# EasyEDA Pro project G1_双向DC.eprj

# Schematic 双向DC-DC
Board Name: 双向DC-DC; Create Date: 2025-09-13; Page Name: Sheet_1; Project Name: G1_双向DC; Schematic Name: 双向DC-DC; Update Date: 2026-01-24; Add into BOM: yes; Company: Your Company; Convert to PCB: yes; Date: 2022-06-02; Draw By: yy1y4n9; REV: 1.0; Sheet: 1/1
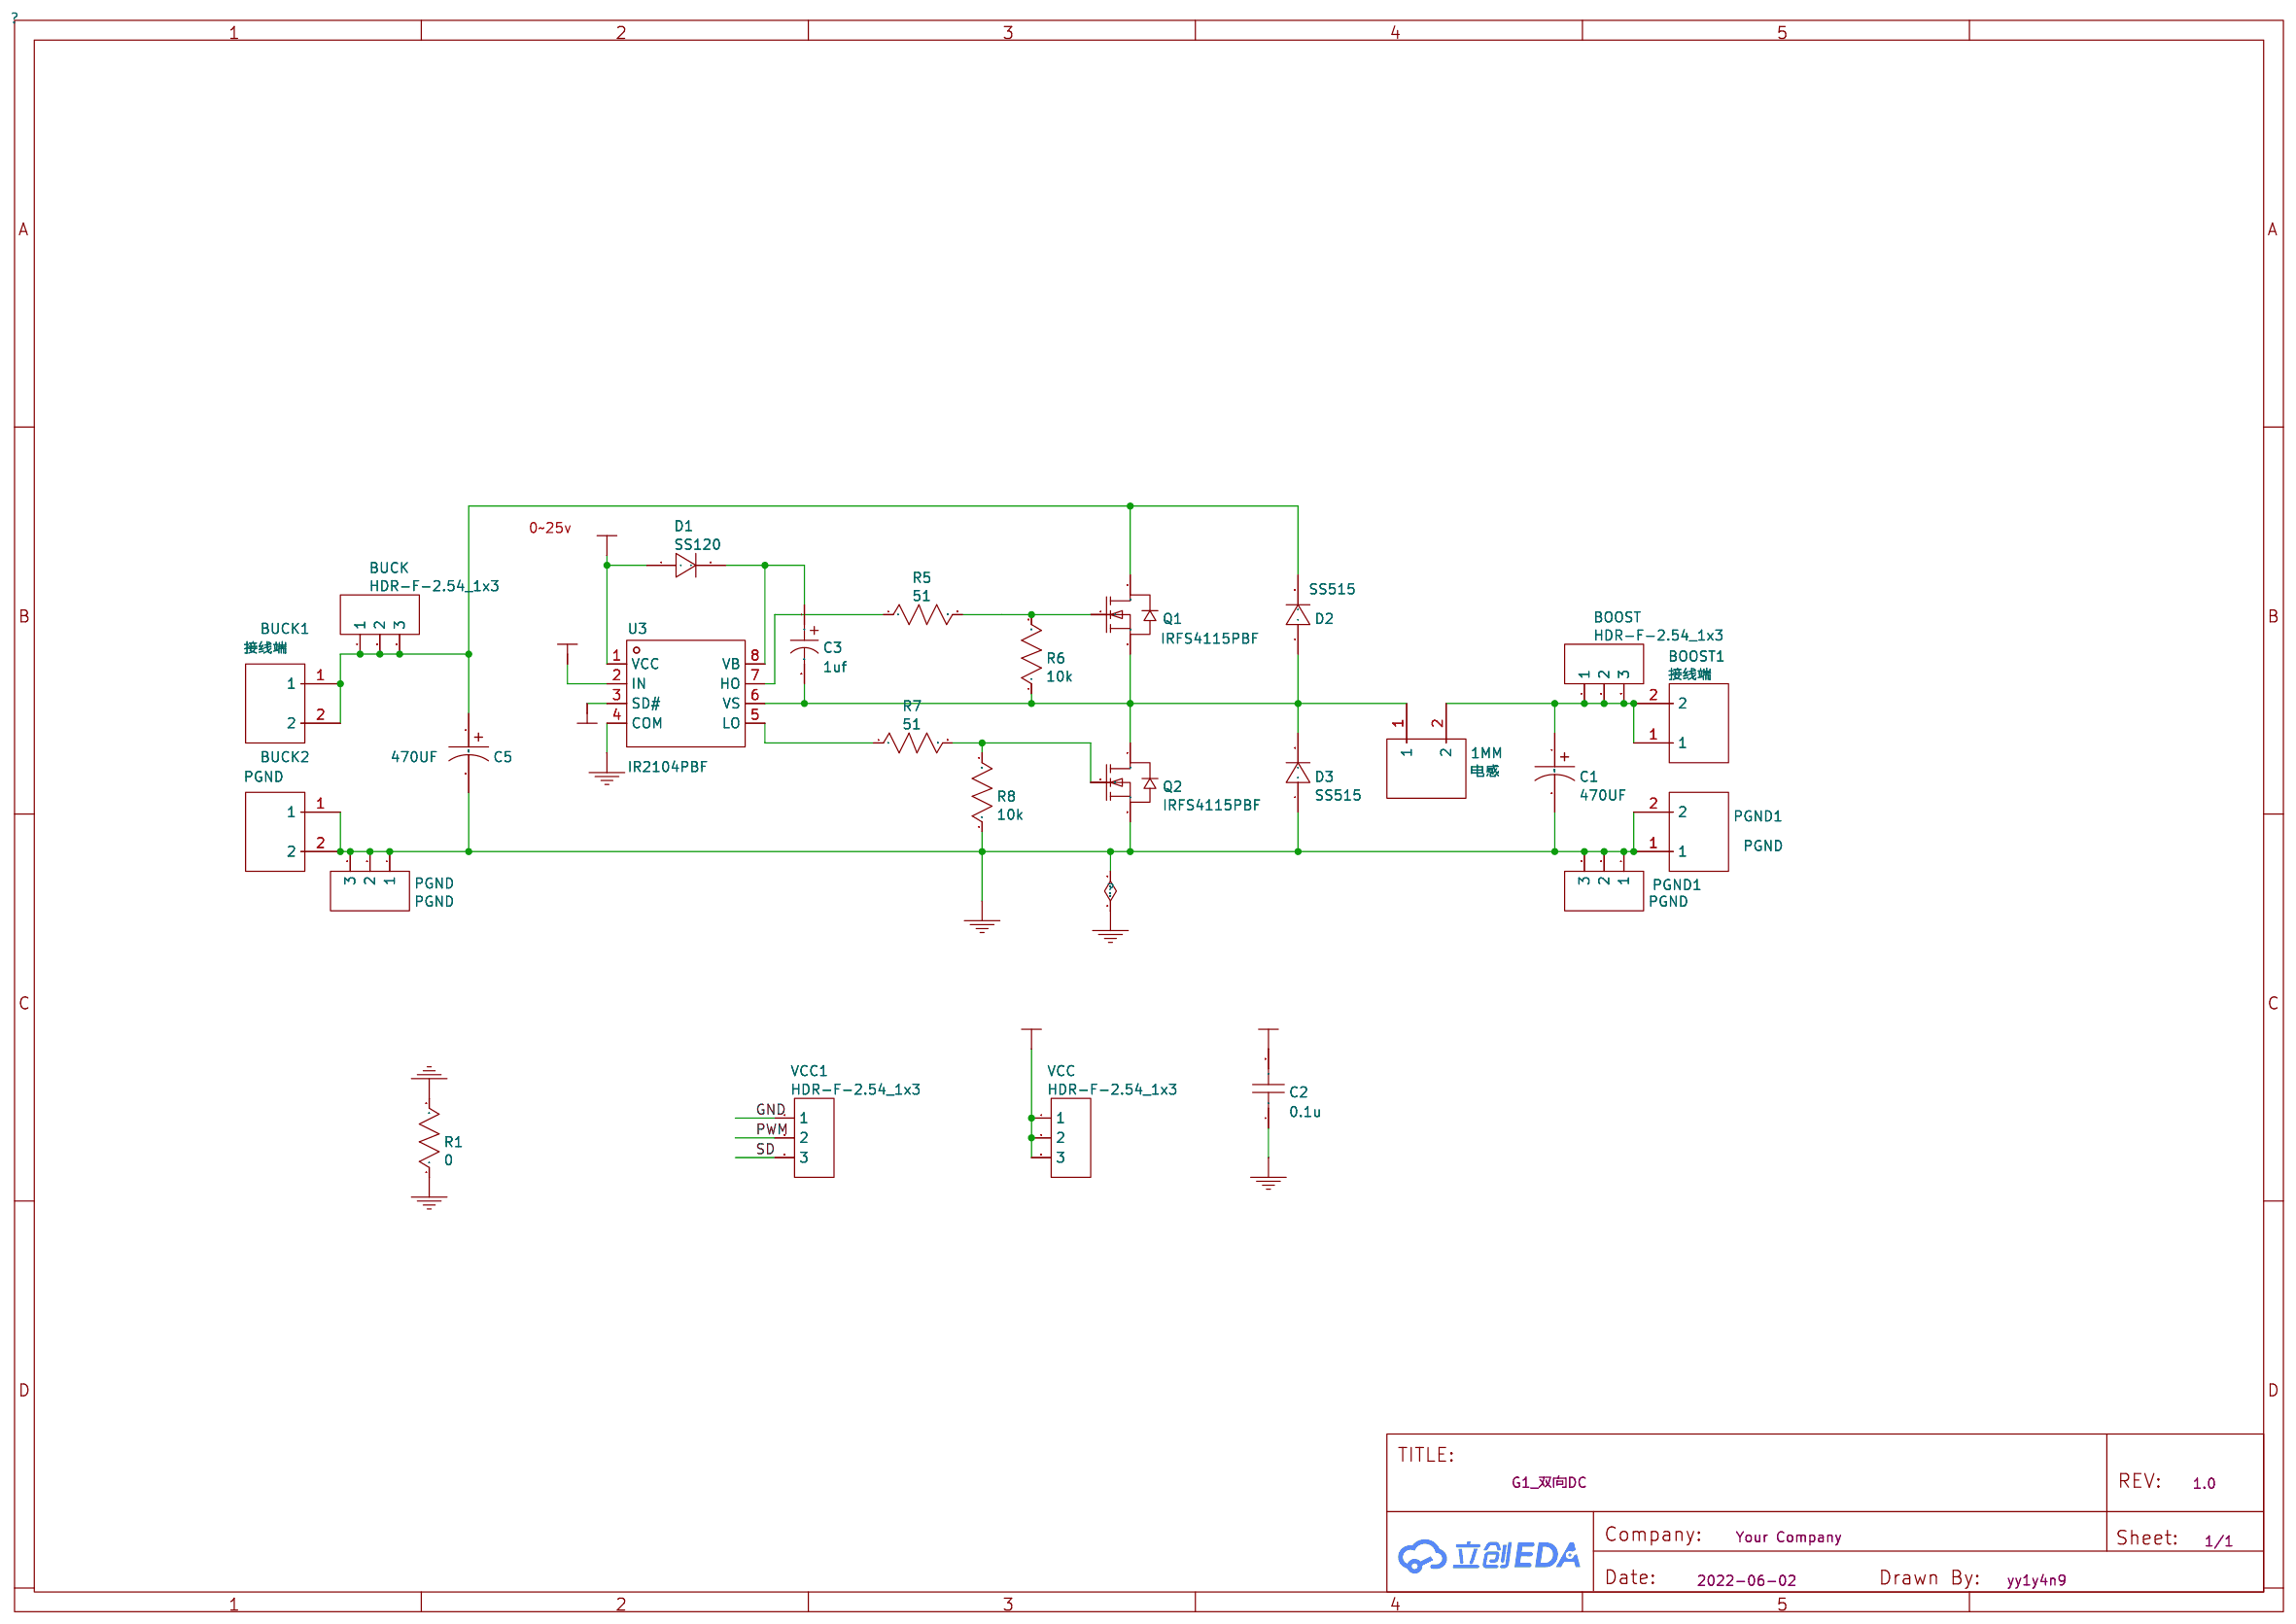
[diagram p0: schematic sheet]

## Parts
1MM  电感  [大电感2.6MM]
BOOST  HDR-F-2.54_1x3  [HDR-F-2.54_1X3]
BOOST1  接线端  [2P接线端子2]
BUCK  HDR-F-2.54_1x3  [HDR-F-2.54_1X3]
BUCK1  接线端  [2P接线端子2]
BUCK2  PGND  [2P接线端子2]
C1  470UF  [电解电容470/100V_16_7.62]
C2  0.1u  [C0805]
C3  1uf  [钽电容A型]
C5  470UF  [电解电容470/100V_16_7.62]
D1  SS120  [SMA封装]
D2  SS515  [SMA封装]
D3  SS515  [SMA封装]
PGND  PGND  [HDR-F-2.54_1X3]
PGND1  PGND  [HDR-F-2.54_1X3]
PGND1#2  PGND  [2P接线端子2]
Q1  IRFS4115PBF  [TO-220AB-3_L10.4-W4.6-P2.54-L]
Q2  IRFS4115PBF  [TO-220AB-3_L10.4-W4.6-P2.54-L]
R1  0  [R0805]
R5  51  [R0805]
R6  10k  [R0805]
R7  51  [R0805]
R8  10k  [R0805]
U3  IR2104PBF  [DIP-8_L9.9-W6.6-P2.54-LS7.62-BL]
VCC  HDR-F-2.54_1x3  [HDR-F-2.54_1X3]
VCC1  HDR-F-2.54_1x3  [HDR-F-2.54_1X3]

## Library data of the parts
1MM = 电感: Supplier: LCSC; Manufacturer: ReliaPro; Manufacturer Part: WJ126V-5.0-2P; image: //image.lceda.cn/szlcsc/C8404.jpg; Supplier Part: C8404
BOOST BUCK PGND PGND1 VCC VCC1 = HDR-F-2.54_1x3: Supplier Part: C146690; Supplier: LCSC
BOOST1 BUCK1 BUCK2 PGND1#2 = 接线端: Supplier: LCSC; Manufacturer: ReliaPro; Manufacturer Part: WJ126V-5.0-2P; image: //image.lceda.cn/szlcsc/C8404.jpg; Supplier Part: C8404
C1 C5 = 1u
C2 = 0.1u
C3 = C1: Supplier: LCSC; Supplier Part: C9900012632; Manufacturer: null; Manufacturer Part: 江海电解电容CD26325V/470uF体积10*12.5mm; JLCPCB Part Class: Extended Part
D1 = M7
D2 D3 = RF307G
Q1 Q2 = IRF540N: Supplier: LCSC; Supplier Part: C693382; Manufacturer: VBsemi Elec; JLCPCB Part Class: Extended Part
R1 = 0
R5-R8 = 1k
U3 = IR2104PBF: 驱动配置:半桥;负载类型:MOSFET；IGBT;驱动通道数:2;峰值灌电流:360mA;峰值拉电流:210mA;电源电压:10V~20V;上升时间:100ns;下降时间:50ns;; LCSC Part Name: IR2104PBF 停产; Supplier Part: C2959; Manufacturer: Infineon(英飞凌); Supplier Footprint: PDIP-8; Datasheet: https://atta.szlcsc.com/upload/public/pdf/source/20140906/1457707236579.pdf; Supplier: LCSC; Driven Configuration: 半桥; Load Type: MOSFET；IGBT; Number of Drivers: 2; Peak Output Current(sink): 360mA; Peak Output Current(source): 210mA; Supply Voltage: 10V~20V; Rise Time: 100ns; Fall Time: 50ns; Operating Temperature: -40℃~+150℃@(Tj)

## Nets
GND: BUCK2.1 BUCK2.2 C1.2 C2.1 C5.2 D3.1(A) PGND.1 PGND.2 PGND.3 PGND1.1 PGND1.2 PGND1.3 PGND1#2.1 PGND1#2.2 Q2.3(S) R1.1 R1.2 R8.1 U3.4(COM) VCC1.1
VCC: C2.2 D1.1(A) U3.1(VCC) VCC.1 VCC.2 VCC.3
PWM: U3.2(IN) VCC1.2
SD: U3.3(SD#) VCC1.3
$1N5: C3.1 D1.2(K) U3.8(VB)
$1N6: 1MM.1 C3.2 D2.1(A) D3.2(K) Q1.3(S) Q2.2(D) R6.1 U3.6(VS)
$1N12: Q2.1(G) R7.2 R8.2
$1N13: R7.1 U3.5(LO)
$1N14: R5.1 U3.7(HO)
$1N15: Q1.1(G) R5.2 R6.2
$1N3304: 1MM.2 BOOST.1 BOOST.2 BOOST.3 BOOST1.1 BOOST1.2 C1.1
$1N5227: BUCK.1 BUCK.2 BUCK.3 BUCK1.1 BUCK1.2 C5.1 D2.2(K) Q1.2(D)

## Notes on the sheet
- 0~25v

# Board PCB_双向DC-DC_大电感_2024-05-11
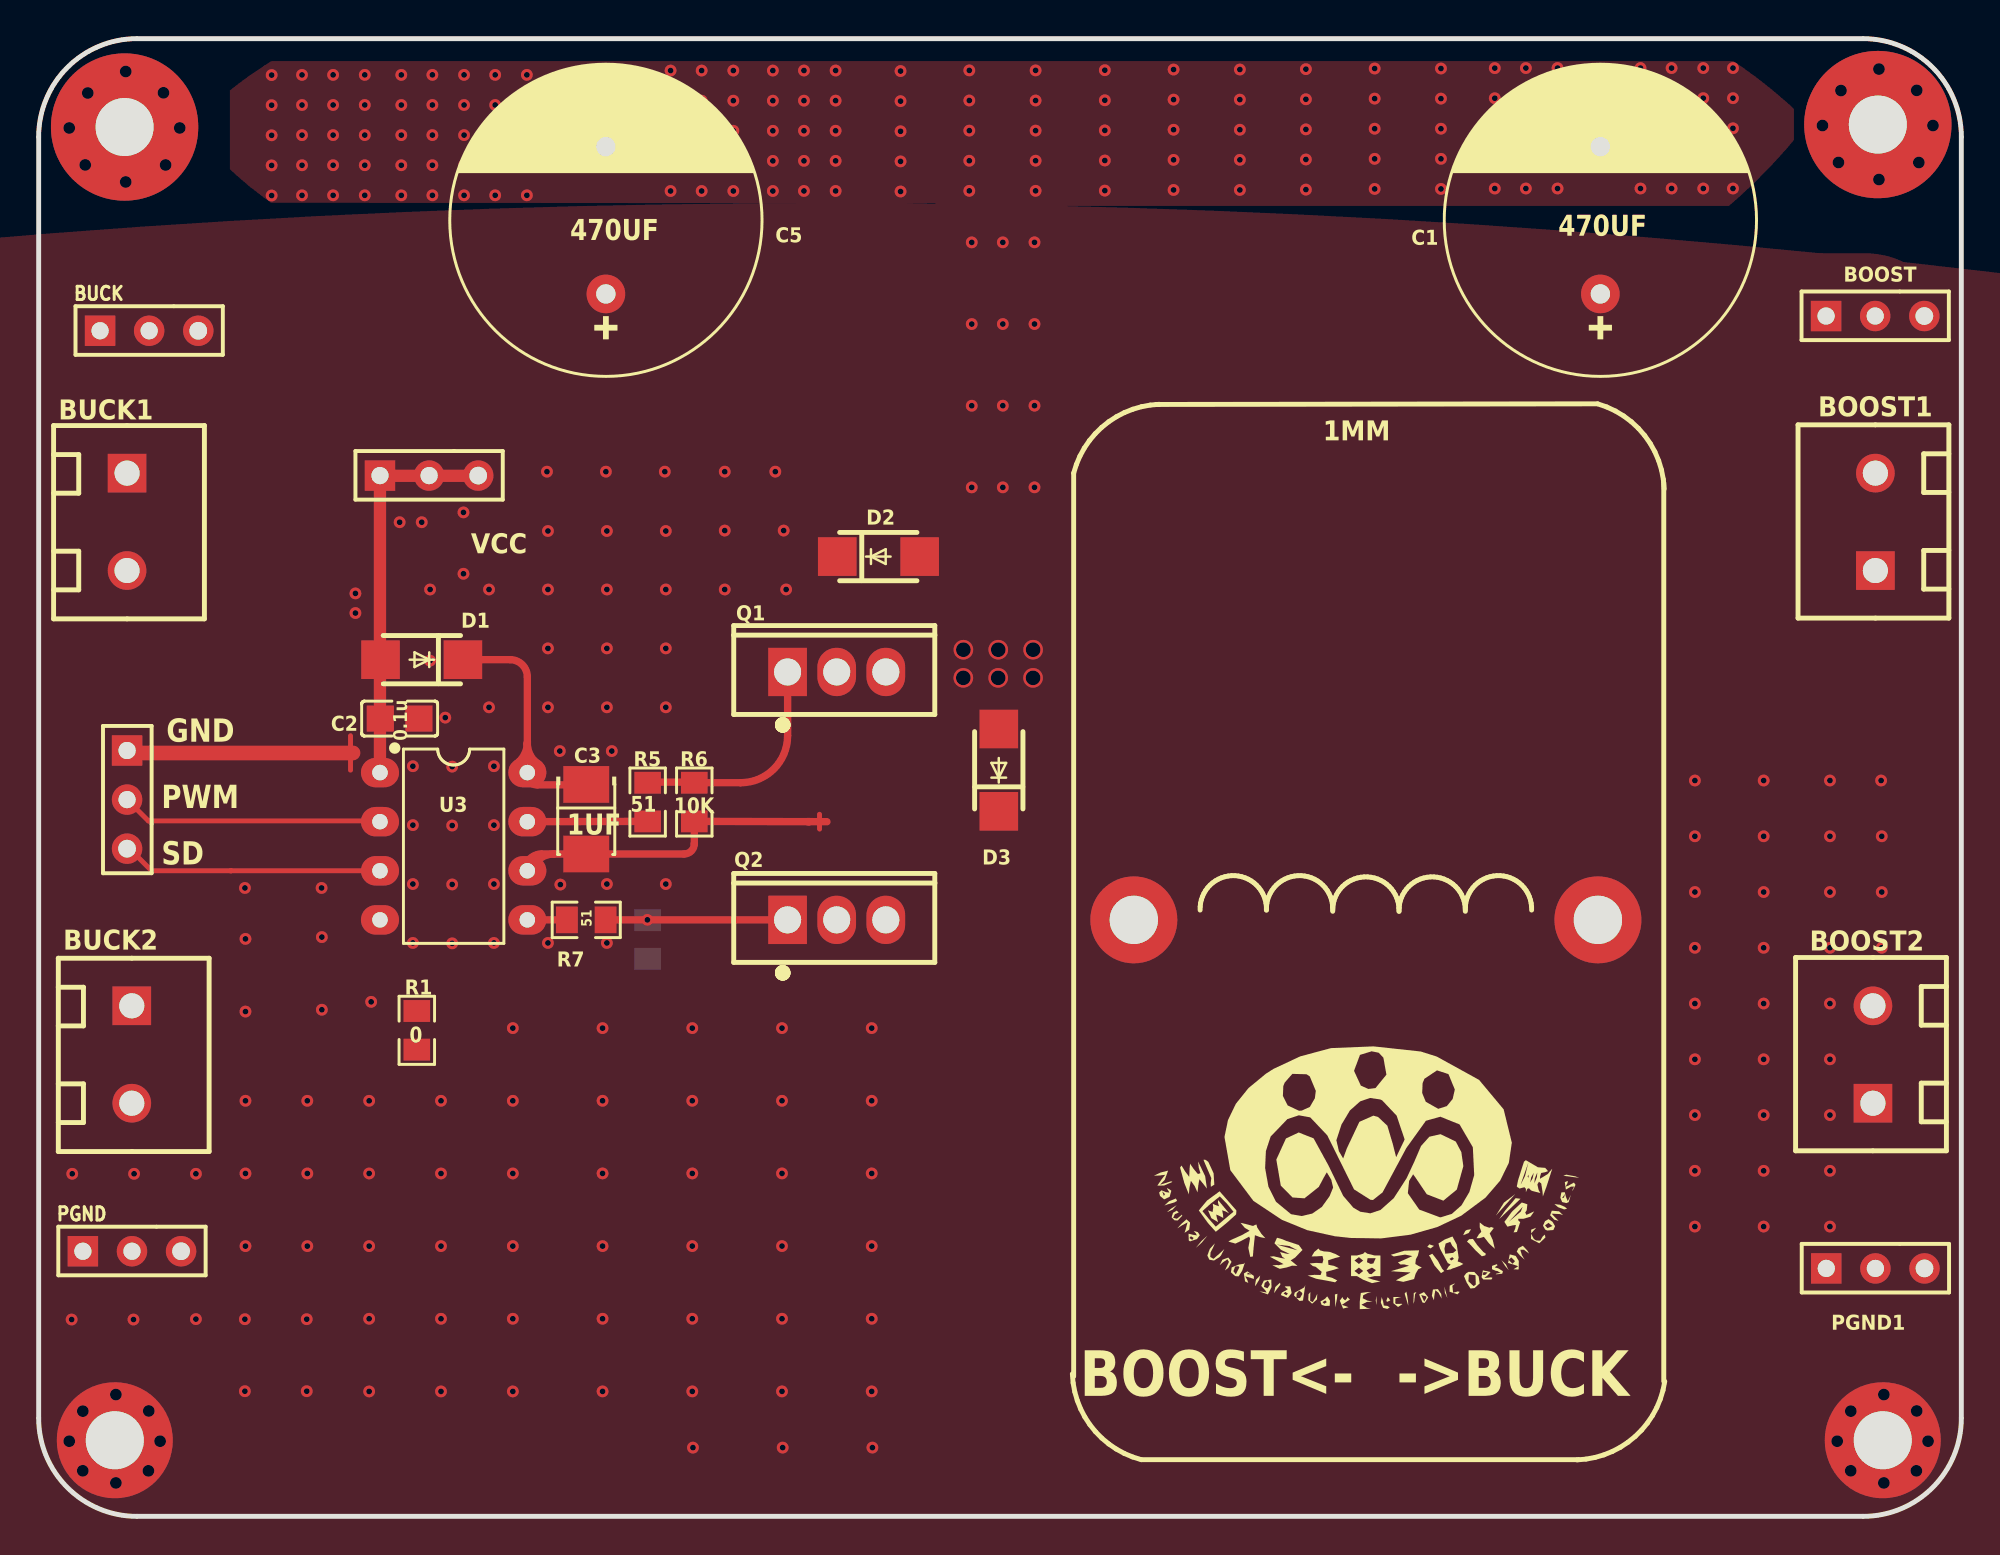
[diagram p1: board, top side]
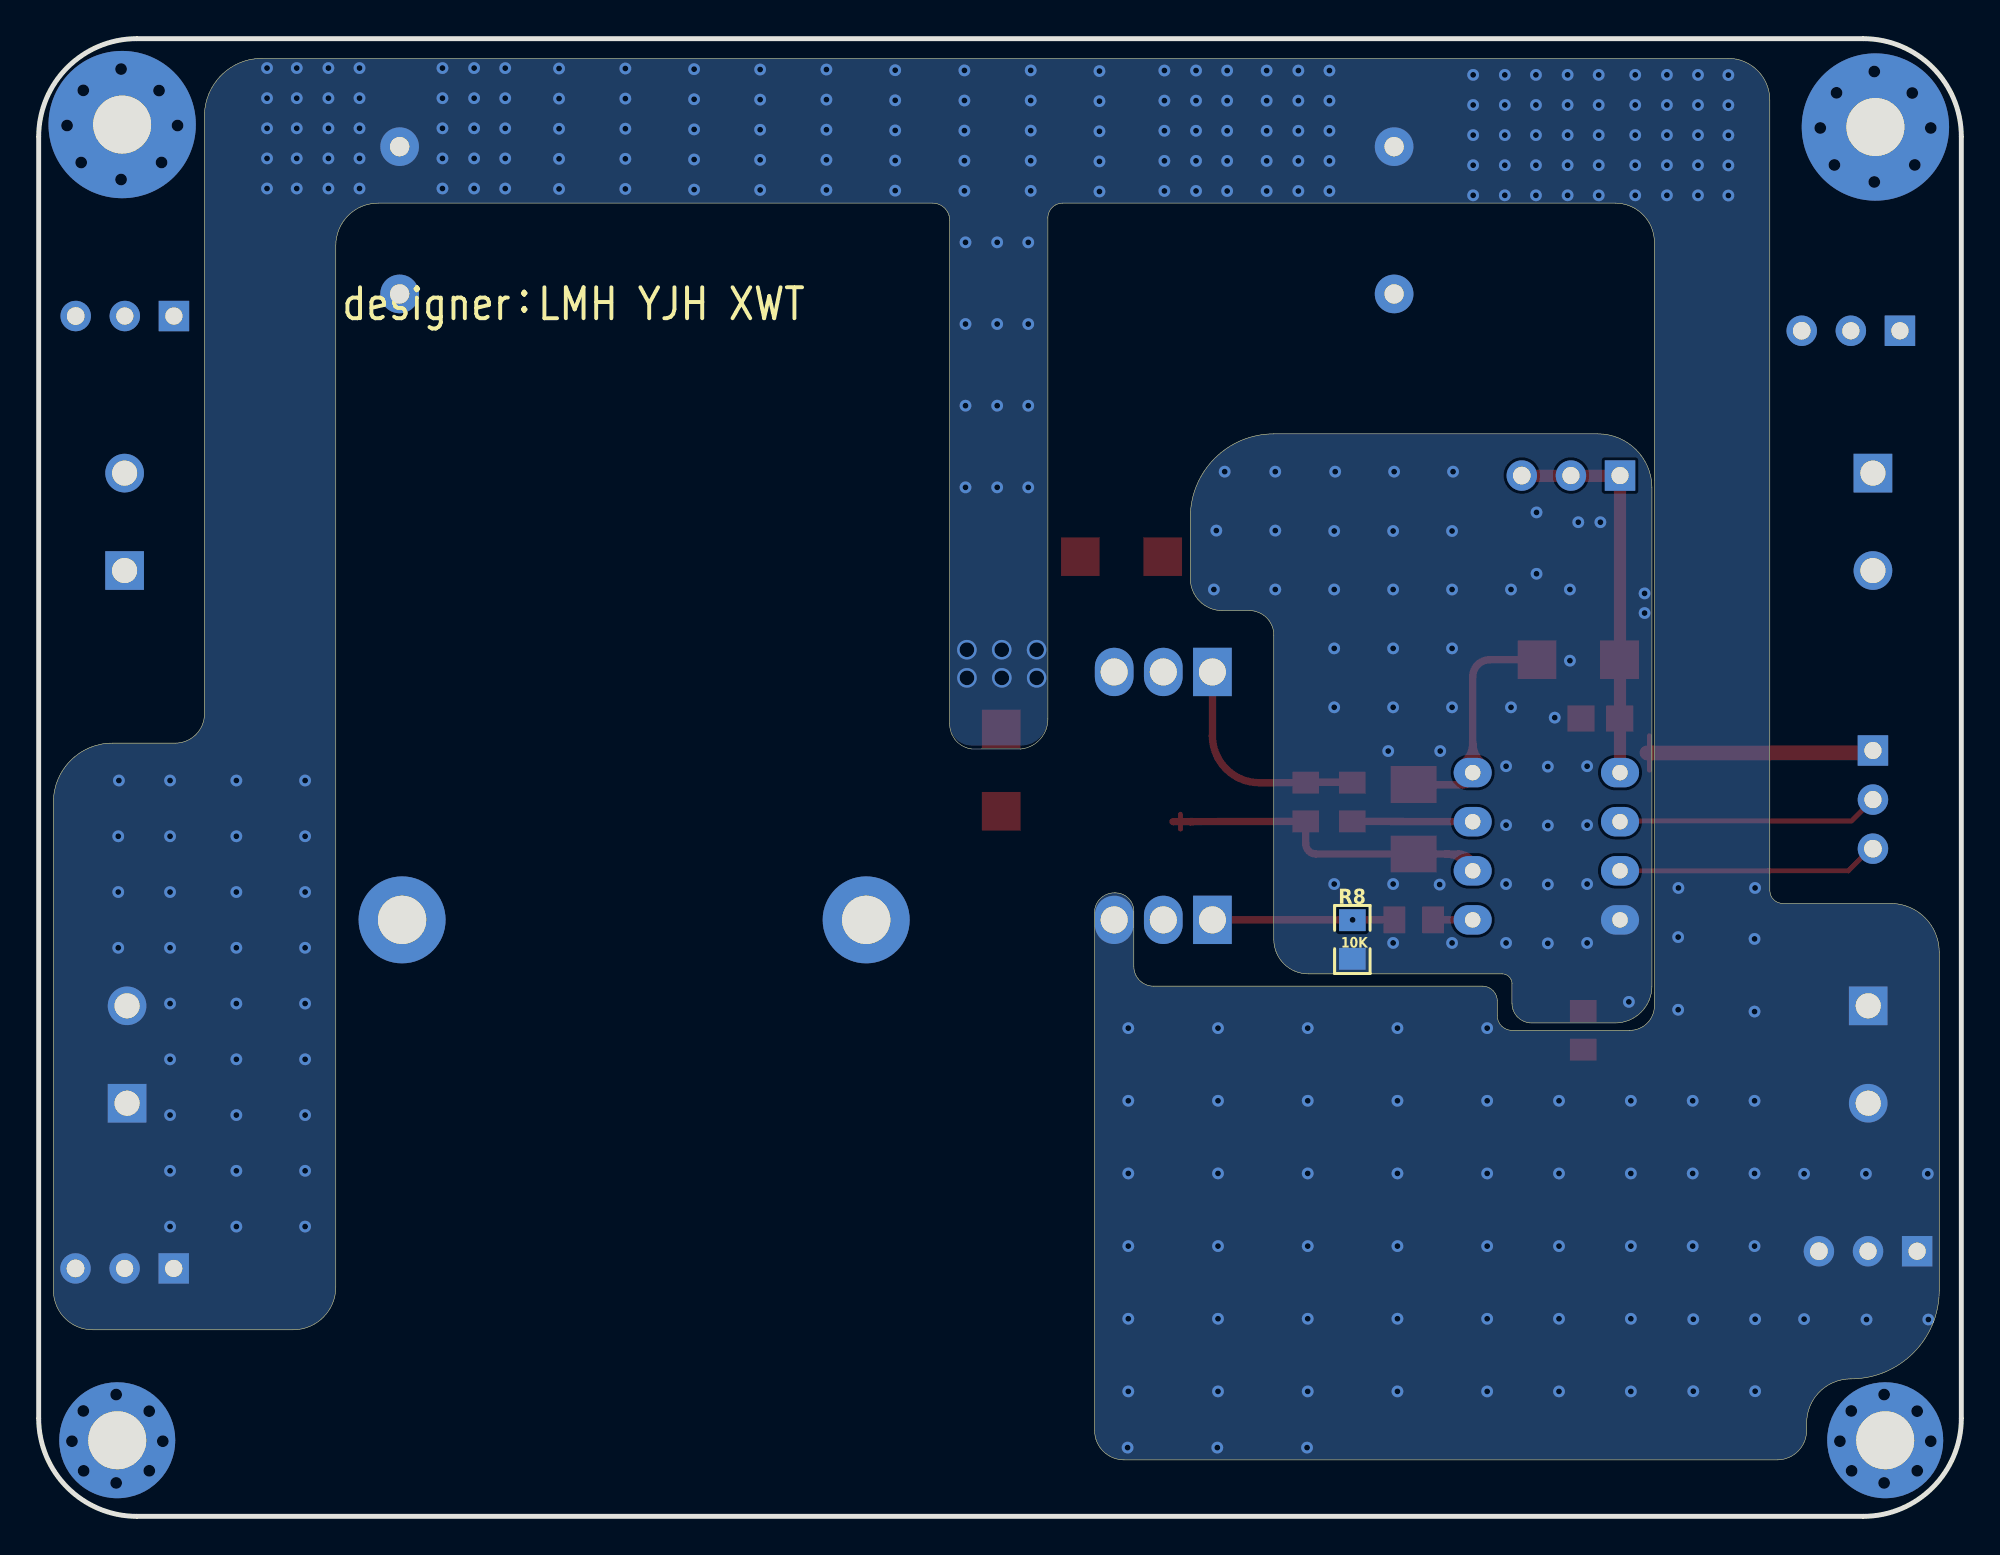
[diagram p2: board, bottom side, seen from below]

Outline 99.44 x 76.45 mm; copper layers: Top Layer, Bottom Layer. Coordinates in mm from the lower left corner of the outline.
Outline path: 0,71.37 0,5.08 arc(1.49,1.49) 5.08,0 94.36,0 arc(97.95,1.49) 99.44,5.08 99.44,71.37 arc(97.95,74.97) 94.36,76.45 5.08,76.45 arc(1.49,74.97) 0,71.37
Stack: Top Layer 0.035mm / Dielectric1 1.51mm FR4 er 4.5 / Bottom Layer 0.035mm

## Design rules (mm)
template: 用户自定义配置
spacing Default (default): track to track 0.152, other pairs 0 to 0.152
track width Default (default): min 0.025, default 0.254, max 25.4
differential pair differentialPair (default): width min 0.127, default 0.254, max 2.54; gap min 0.152, default 0.152
via Default (default): diameter min 0.61, default 0.61, max 100.025; hole min 0.305, default 0.305, max 59.995
pour e1009 uses Default

## Placement (name value [footprint] x y rotation side)
1MM  电感  [大电感2.6MM]  68.58 30.86 0 top
BOOST  HDR-F-2.54_1x3  [HDR-F-2.54_1X3]  94.99 62.1 0 top
BOOST1  接线端  [2P接线端子2]  95 51.47 180 top
BOOST2  PGND  [2P接线端子2]  94.87 23.91 180 top
BUCK  HDR-F-2.54_1x3  [HDR-F-2.54_1X3]  5.71 61.34 0 top
BUCK1  接线端  [2P接线端子2]  4.57 51.44 0 top
BUCK2  PGND  [2P接线端子2]  4.82 23.88 0 top
C1  470UF  [电解电容470/100V_16_7.62]  80.77 67.06 90 top
C2  0.1u  [C0805]  18.67 41.28 180 top
C3  1uf  [钽电容A型]  28.32 36.07 270 top
C5  470UF  [电解电容470/100V_16_7.62]  29.34 67.06 90 top
D1  SS120  [SMA封装]  19.81 44.32 0 top
D2  SS515  [SMA封装]  43.43 49.66 180 top
D3  SS515  [SMA封装]  49.66 38.61 270 top
NOREF  -  [Pad_e682]  95.38 3.94 90 top
NOREF#2  -  [Pad_e673]  3.94 3.94 90 top
NOREF#3  -  [Pad_e664]  95.12 72.01 90 top
NOREF#4  -  [Pad_e631]  4.44 71.88 90 top
PGND  PGND  [HDR-F-2.54_1X3]  4.83 13.72 0 top
PGND1  PGND  [HDR-F-2.54_1X3]  95 12.83 0 top
Q1  IRFS4115PBF  [TO-220AB-3_L10.4-W4.6-P2.54-L]  41.28 43.69 0 top
Q2  IRFS4115PBF  [TO-220AB-3_L10.4-W4.6-P2.54-L]  41.28 30.86 0 top
R1  0  [R0805]  19.56 25.15 270 top
R5  51  [R0805]  31.5 36.96 90 top
R6  10k  [R0805]  33.91 36.96 90 top
R7  51  [R0805]  28.32 30.86 0 top
R8  10k  [R0805]  31.5 29.84 90 bottom
U3  IR2104PBF  [DIP-8_L9.9-W6.6-P2.54-LS7.62-BL]  21.46 34.67 270 top
VCC  HDR-F-2.54_1x3  [HDR-F-2.54_1X3]  20.19 53.85 0 top
VCC1  HDR-F-2.54_1x3  [HDR-F-2.54_1X3]  4.57 37.08 270 top

## Footprints (pads in the part's own frame, mm; a bottom-side part is the same pattern mirrored in y, then rotated)
2P接线端子2
  rect 2x2 hole 1.3: 1(0,2.54)
  round 2 hole 1.3: 2(0,-2.501)
C0805
  rect 1.41x1.35 smd: 1(-1,0) 2(1,0)
DIP-8_L9.9-W6.6-P2.54-LS7.62-BL
  oval 1.524x1.97 hole 0.8: 1(-3.81,-3.81) 2(-1.27,-3.81) 3(1.27,-3.81) 4(3.81,-3.81) 5(3.81,3.81) 6(1.27,3.81) 7(-1.27,3.81) 8(-3.81,3.81)
HDR-F-2.54_1X3
  rect 1.575x1.575 hole 0.889: 1(-2.54,0)
  round 1.575 hole 0.889: 2(0,0)
  round 1.575 hole 0.914: 3(2.54,0)
Pad_e631
  round 7.62 hole 3: 1(0,0)
Pad_e664
  round 7.62 hole 3: 1(0,0)
Pad_e673
  round 6 hole 3: 1(0,0)
Pad_e682
  round 6 hole 3: 1(0,0)
R0805
  rect 1.133x1.377 smd: 1(-1,0) 2(1,0)
SMA封装
  rect 2x2 smd: 1(-2.13,0) 2(2.13,0)
TO-220AB-3_L10.4-W4.6-P2.54-L
  rect 2x2.5 hole 1.4: 1(-2.54,0)
  oval 2x2.5 hole 1.4: 2(0,0) 3(2.54,0)
大电感2.6MM
  round 4.5 hole 2.5: 1(-11.938,0) 2(12.065,0)
电解电容470/100V_16_7.62
  round 2 hole 1: 1(-3.81,0) 2(3.81,0)
钽电容A型
  rect 1.9x2.376 smd: 1(-1.798,0) 2(1.798,0)

## Nets
As in the schematic, except:
GND: BOOST2.1 BOOST2.2 BUCK2.1 BUCK2.2 C1.2 C2.1 C5.2 D3.1 PGND.1 PGND.2 PGND.3 PGND1.1 PGND1.2 PGND1.3 Q2.3 R1.1 R1.2 R8.1 U3.4 VCC1.1

Pads without a net: NOREF 1; NOREF#2 1; NOREF#3 1; NOREF#4 1

## Via types
v1: diameter 1.219, hole 0.61, Top Layer to Bottom Layer, 32 vias
v2: diameter 0.61, hole 0.305, Top Layer to Bottom Layer, 316 vias
v3: diameter 1.016, hole 0.762, Top Layer to Bottom Layer, 6 vias

## Routing (per net, layer and track width the routed paths; a pad name or vN(x,y) marks a point on that pad's centre or on a via; arc(x,y) is an arc through that point)
GND: length 13.3
  Top Layer w0.254: 16.13,40.39 16.13,38.61
  Top Layer w0.762: 4.7,39.5 16.26,39.5
  vias: v2(12.05,74.57) v2(12.05,73.01) v2(12.05,71.45) v2(12.05,69.9) v2(12.05,68.34) v2(13.62,74.58) v2(13.62,73.02) v2(13.62,71.46) v2(13.62,69.9) v2(13.62,68.35) v2(15.23,74.58) v2(15.23,73.02) v2(15.23,71.46) v2(15.23,69.91) v2(15.23,68.35) v2(16.38,47.75) v2(16.38,46.74) v2(16.87,74.58) v2(16.87,73.02) v2(16.87,71.46) v2(16.87,69.91) v2(16.87,68.35) v2(17.2,26.62) v2(18.67,51.44) v2(18.76,74.58) v2(18.76,73.02) v2(18.76,71.46) v2(18.76,69.9) v2(18.76,68.35) v2(19.35,38.81) v2(19.35,35.76) v2(19.35,32.72) v2(19.35,29.67) v2(19.81,51.44) v2(20.24,47.95) v2(20.24,44.27) v2(20.36,74.58) v2(20.36,73.02) v2(20.36,71.46) v2(20.36,69.91) v2(20.36,68.35) v2(21.03,41.32) v2(21.39,38.79) v2(21.39,35.74) v2(21.39,32.69) v2(21.39,29.65) v2(21.97,51.94) v2(21.97,48.77) v2(22,74.58) v2(22,73.02) v2(22,71.46) v2(22,69.91) v2(22,68.35) v2(23.29,47.95) v2(23.29,41.86) v2(23.55,38.81) v2(23.55,35.76) v2(23.55,32.72) v2(23.55,29.67) v2(23.61,74.58) v2(23.61,73.02) v2(23.61,71.46) v2(23.61,69.91) v2(23.61,68.35) v2(25.25,74.58) v2(25.25,73.02) v2(25.25,71.46) v2(25.25,69.91) v2(25.25,68.35) v2(26.29,54.05) v2(26.34,50.98) v2(26.34,47.95) v2(26.34,44.91) v2(26.34,41.86) v2(26.34,29.67) v2(26.95,39.59) v2(26.98,32.69) v2(29.34,54.05) v2(29.39,50.98) v2(29.39,47.95) v2(29.39,44.91) v2(29.39,41.86) v2(29.39,32.72) v2(29.39,29.67) v2(29.64,39.59) v2(32.38,54.05) v2(32.44,50.98) v2(32.44,47.95) v2(32.44,44.91) v2(32.44,41.86) v2(32.44,32.72) v2(32.68,74.8) v2(32.68,73.25) v2(32.68,71.69) v2(32.68,70.13) v2(32.68,68.57) v2(34.29,74.8) v2(34.29,73.25) v2(34.29,71.69) v2(34.29,70.13) v2(34.29,68.57) v2(35.48,54.05) v2(35.48,51) v2(35.48,47.95) v2(35.93,74.8) v2(35.93,73.25) v2(35.93,71.69) v2(35.93,70.13) v2(35.93,68.57) v2(37.97,74.8) v2(37.97,73.25) v2(37.97,71.69) v2(37.97,70.13) v2(37.97,68.57) v2(38.1,54.05) v2(38.53,51) v2(38.66,47.95) v2(39.58,74.81) v2(39.58,73.25) v2(39.58,71.69) v2(39.58,70.13) v2(39.58,68.57) v2(41.22,74.81) v2(41.22,73.25) v2(41.22,71.69) v2(41.22,70.13) v2(41.22,68.57) v2(44.58,74.78) v2(44.58,73.22) v2(44.58,71.66) v2(44.58,70.1) v2(44.58,68.55) v2(48.13,74.81) v2(48.13,73.25) v2(48.13,71.7) v2(48.13,70.14) v2(48.13,68.58) v2(48.26,65.91) v2(48.26,61.69) v2(48.26,57.46) v2(48.26,53.24) v2(49.87,65.92) v2(49.87,61.69) v2(49.87,57.46) v2(49.87,53.24) v2(51.56,74.81) v2(51.56,73.25) v2(51.56,71.7) v2(51.56,70.14) v2(51.56,68.58) v2(51.5,65.92) v2(51.5,61.69) v2(51.5,57.46) v2(51.5,53.24) v2(55.14,74.82) v2(55.14,73.27) v2(55.14,71.71) v2(55.14,70.15) v2(55.14,68.59) v2(58.7,74.86) v2(58.7,73.3) v2(58.7,71.74) v2(58.7,70.18) v2(58.7,68.63) v2(62.13,74.86) v2(62.13,73.3) v2(62.13,71.74) v2(62.13,70.18) v2(62.13,68.63) v2(65.54,74.88) v2(65.54,73.32) v2(65.54,71.76) v2(65.54,70.2) v2(65.54,68.64) v2(69.1,74.91) v2(69.1,73.35) v2(69.1,71.79) v2(69.1,70.24) v2(69.1,68.68) v2(72.53,74.91) v2(72.53,73.35) v2(72.53,71.79) v2(72.53,70.24) v2(72.53,68.68) v2(75.31,74.93) v2(75.31,73.37) v2(75.31,71.81) v2(75.31,70.26) v2(75.31,68.7) v2(76.92,74.93) v2(76.92,73.37) v2(76.92,71.82) v2(76.92,70.26) v2(76.92,68.7) v2(78.56,74.93) v2(78.56,73.37) v2(78.56,71.82) v2(78.56,70.26) v2(78.56,68.7) v2(82.85,74.93) v2(82.85,73.37) v2(82.85,71.82) v2(82.85,70.26) v2(82.85,68.7) v2(84.46,74.93) v2(84.46,73.37) v2(84.45,71.82) v2(84.46,70.26) v2(84.46,68.7) v2(86.09,74.93) v2(86.09,73.37) v2(86.09,71.82) v2(86.09,70.26) v2(86.09,68.7) v2(87.63,74.93) v2(87.63,73.37) v2(87.63,71.82) v2(87.63,70.26) v2(87.63,68.7) v3(47.83,44.84) v3(47.82,43.38) v3(49.63,44.84) v3(49.63,43.38) v3(51.43,44.84) v3(51.43,43.38)
PGND:
  vias: v2(1.74,17.72) v2(1.71,10.18) v2(4.93,17.72) v2(4.9,10.18) v2(8.13,17.72) v2(8.13,10.21) v2(10.67,32.51) v2(10.66,10.2) v2(10.66,6.47) v2(10.7,29.88) v2(10.7,26.12) v2(10.7,21.5) v2(10.7,17.74) v2(10.7,13.98) v2(13.86,10.2) v2(13.86,6.47) v2(13.89,21.5) v2(13.89,17.74) v2(13.89,13.98) v2(14.63,32.51) v2(14.65,29.97) v2(14.65,26.21) v2(17.09,21.5) v2(17.09,17.74) v2(17.09,13.98) v2(17.09,10.22) v2(17.09,6.46) v2(20.81,21.5) v2(20.81,17.74) v2(20.81,13.98) v2(20.81,10.22) v2(20.81,6.46) v2(24.52,25.26) v2(24.52,21.5) v2(24.52,17.74) v2(24.52,13.98) v2(24.52,10.22) v2(24.52,6.46) v2(29.16,25.26) v2(29.16,21.5) v2(29.16,17.74) v2(29.16,13.98) v2(29.16,10.22) v2(29.16,6.46) v2(33.81,25.26) v2(33.81,21.5) v2(33.81,17.74) v2(33.81,13.98) v2(33.81,10.22) v2(33.81,6.46) v2(33.84,3.56) v2(38.45,25.26) v2(38.45,21.5) v2(38.45,17.74) v2(38.45,13.98) v2(38.45,10.22) v2(38.45,6.46) v2(38.48,3.56) v2(43.09,25.26) v2(43.09,21.5) v2(43.09,17.74) v2(43.09,13.98) v2(43.09,10.22) v2(43.09,6.46) v2(43.12,3.56) v2(85.66,38.07) v2(85.66,35.19) v2(85.66,32.3) v2(85.66,29.42) v2(85.66,26.53) v2(85.66,23.65) v2(85.66,20.76) v2(85.66,17.88) v2(85.66,14.99) v2(89.22,38.07) v2(89.22,35.19) v2(89.22,32.3) v2(89.22,29.42) v2(89.22,26.53) v2(89.22,23.65) v2(89.22,20.76) v2(89.22,17.88) v2(89.22,14.99) v2(92.65,38.07) v2(92.65,35.19) v2(92.65,32.3) v2(92.65,29.42) v2(92.65,26.53) v2(92.65,23.65) v2(92.65,20.76) v2(92.65,17.88) v2(92.65,14.99) v2(95.29,38.07) v2(95.33,35.19) v2(95.33,32.3) v2(95.33,29.42)
VCC: length 20.4
  Top Layer w0.635: VCC.1 U3.1 ; 22.72,53.84 17.71,53.84 arc(17.68,53.84) 17.66,53.86
(no net):
  vias: v1(1.58,71.83) v1(1.58,3.89) v1(2.28,5.44) v1(2.28,2.36) v1(2.41,69.92) v1(2.54,73.64) v1(3.99,6.3) v1(3.99,1.73) v1(4.5,74.75) v1(4.5,69.04) v1(5.68,2.35) v1(5.69,5.45) v1(6.28,3.89) v1(6.46,73.65) v1(6.56,69.92) v1(7.3,71.83) v1(92.26,71.96) v1(93.09,70.05) v1(93.02,3.89) v1(93.22,73.77) v1(93.72,5.44) v1(93.72,2.36) v1(95.18,74.88) v1(95.18,69.17) v1(95.43,6.3) v1(95.43,1.73) v1(97.13,73.78) v1(97.13,5.45) v1(97.12,2.35) v1(97.24,70.05) v1(97.72,3.89) v1(97.97,71.96)
PWM: length 14.1
  Top Layer w0.254: 4.19,37.47 VCC1.2 5.68,35.98 17.56,35.98 arc(17.61,35.97) U3.2
SD: length 14
  Top Layer w0.254: 9.96,33.4 5.84,33.4 4.32,34.92 ; 9.96,33.4 U3.3 ; 9.96,33.4 arc(9.93,33.4) 9.89,33.4
$1N5: length 15.4
  Top Layer w0.381: 25.15,38.48 arc(25.33,38.03) 25.78,37.85 28.32,37.85 ; 25.27,39.95 U3.8 ; 25.27,39.95 25.27,43.43 arc(25.01,44.06) 24.38,44.32 D1.2 ; 25.27,39.95 arc(25.27,39.96) 25.27,39.96 ; 25.27,39.95 arc(25.15,39.47) 24.86,39.06 24.54,38.74 ; 25.99,38.74 25.66,39.07 arc(25.38,39.48) 25.27,39.96 ; 25.27,39.96 arc(25.27,39.98) 25.27,40 ; 25.27,39.96 arc(25.28,40.02) 25.28,40.07
$1N6: length 20.1
  Top Layer w0.254: 40.39,36.32 40.39,35.56
  Top Layer w0.381: 25.15,33.4 arc(25.4,34.02) 26.01,34.27 26.66,34.27 ; U3.6 25.78,33.91 arc(26.18,34.18) 26.66,34.27 ; 39.75,35.94 39.84,35.94 arc(39.85,35.94) 39.87,35.94 ; 39.75,35.94 R6.1 33.91,34.8 arc(33.75,34.42) 33.38,34.27 C3.2 26.66,34.27 ; 39.75,35.94 39.87,35.94 ; 40.77,35.94 40.39,35.94 39.87,35.94
$1N12: length 9.4
  Top Layer w0.381: 29.34,30.84 arc(29.33,30.85) R7.2 v2(31.48,30.86) Q2.1
$1N13: length 2.2
  Top Layer w0.381: 25.15,30.86 R7.1
$1N14: length 6.4
  Top Layer w0.381: 25.15,35.94 R5.1
$1N15: length 12
  Top Layer w0.381: 38.73,42.78 38.73,40.39 arc(38.02,38.67) 36.31,37.96 R6.2 33.88,37.99 31.53,37.99 R5.2
  Top Layer w0.635: Q1.1 38.73,42.78

## Copper pours and planes (outline as drawn; the poured copper is in the pictures)
GND on Top Layer: -471.49,75.29 552.76,75.29 552.76,-956.31 -471.49,-956.31
GND on Top Layer: 18.8,55.88 16.01,54.73 14.86,51.94 14.86,48.01 15.05,47.36 15.49,46.86 15.85,46.46 16,45.95 16,27.31 16.56,25.96 17.91,25.4 22.22,25.4 22.94,25.7 23.24,26.42 23.24,27.43 23.39,27.79 23.75,27.94 33.78,27.94 35.04,28.46 35.56,29.72 35.56,45.47 35.93,46.36 36.83,46.74 38.23,46.74 39.39,47.22 39.88,48.39 39.88,51.56 38.61,54.62 35.56,55.88
GND on Bottom Layer: 16,53.21 16.82,55.19 18.8,56.01 35.56,56.01 38.61,54.74 39.88,51.69 39.88,48.51 39.39,47.35 38.23,46.86 36.83,46.86 35.93,46.49 35.56,45.59 35.56,29.84 35.04,28.59 33.78,28.07 23.75,28.07 23.39,27.92 23.24,27.56 23.24,26.54 22.94,25.82 22.22,25.53 17.91,25.53 16.56,26.08 16,27.43
PGND on Top Layer: 10.41,33.02 10.05,32.87 9.91,32.51 9.91,32.39 9.65,31.76 9.02,31.5 2.84,31.5 1.55,30.96 1.02,29.67 1.02,11.34 2.29,8.26 5.37,6.99 6.48,6.99 7.55,6.54 8,5.46 8,4.32 8.45,3.24 9.52,2.79 43.4,2.79 44.41,3.21 44.83,4.22 44.83,31.33 44.82,31.36 44.8,31.37 44.62,31.95 44.09,32.26 43.64,32.26 43.04,32.04 42.8,31.45 42.8,28.21 42.53,27.57 41.9,27.31 24.77,27.31 24.23,27.08 24.01,26.55 24.01,26.54 23.6,25.56 22.61,25.15 17.14,25.15 16.16,25.55 15.75,26.54 15.75,32.51 15.6,32.87 15.24,33.02
PGND on Bottom Layer: 12.06,75.44 10.54,74.81 9.91,73.28 9.91,32.39 9.71,31.91 9.23,31.71 3.66,31.71 1.88,30.98 1.14,29.2 1.14,11.68 2.48,8.45 7.33,6.44 8,4.83 8,4.44 8.45,3.37 9.52,2.92 43.31,2.92 44.38,3.37 44.83,4.44 44.83,31.24 44.53,31.96 43.81,32.26 43.75,32.26 43.08,31.98 42.8,31.31 42.8,28.45 42.5,27.73 41.78,27.43 24.77,27.43 24.23,27.21 24,26.67 24,25.91 23.78,25.37 23.24,25.15 17.14,25.15 16.25,25.52 15.88,26.42 15.88,65.91 16.47,67.35 17.91,67.95 46.48,67.95 47.02,67.72 47.24,67.18 47.24,41.28 47.65,40.29 48.64,39.88 51.18,39.88 51.99,40.21 52.32,41.02 52.32,67.06 52.58,67.68 53.21,67.95 81.88,67.95 83.43,67.3 84.07,65.75 84.07,11.86 84.72,10.3 86.28,9.65 96.65,9.65 98.08,10.25 98.68,11.68 98.68,36.96 97.79,39.11 95.63,40.01 92.38,40.01 91.31,40.45 90.87,41.52 90.87,72.45 89.99,74.56 87.88,75.44
$1N6 on Top Layer: 38.29,35.72 38.2,35.68 38.16,35.59 38.16,33.69 38.68,32.43 39.94,31.91 47.18,31.91 47.36,31.84 47.43,31.66 47.43,30.77 47.84,29.78 48.83,29.37 58.23,29.37 58.95,29.67 59.25,30.39 58.95,31.11 58.23,31.4 55.82,31.4 55.1,31.7 54.8,32.42 54.8,40.1 55.53,41.85 57.28,42.58 60.13,42.58 61.21,43.03 61.66,44.1 61.66,47.15 61.21,48.23 60.13,48.68 52.01,48.68 50.39,48.01 49.72,46.39 49.72,35.09 49.39,34.28 48.58,33.94 41.59,33.94 41.32,34.06 40.8,35.31 39.81,35.72
$1N3304 on Top Layer: 77.6,29.59 78.23,28.06 79.76,27.43 81.03,27.43 82.82,28.18 83.57,29.97 83.57,38.37 84.05,39.53 85.22,40.02 97.35,40.02 98.56,40.52 99.06,41.73 99.06,60.75 99.05,60.75 97.7,64 94.46,65.35 80.05,65.35 78.31,64.63 77.6,62.9
$1N5227 on Top Layer: 1.02,66.29 42.29,66.29 42.29,43.18 1.02,43.18

Small or netless copper shapes (teardrops, artwork), in the pictures only: 36 on Top Layer

## Text on the board
Bottom Silkscreen Layer: 10K | designer：LMH YJH XWT
Top Solder Mask Layer: BOOST<- | ->BUCK
Top Silkscreen Layer: 51 | 0.1u | 0 | 10K | 1UF | 470UF | PWM | SD | GND | BOOST<- | ->BUCK
